# Altium schematic sheet Main.SchDoc
size A
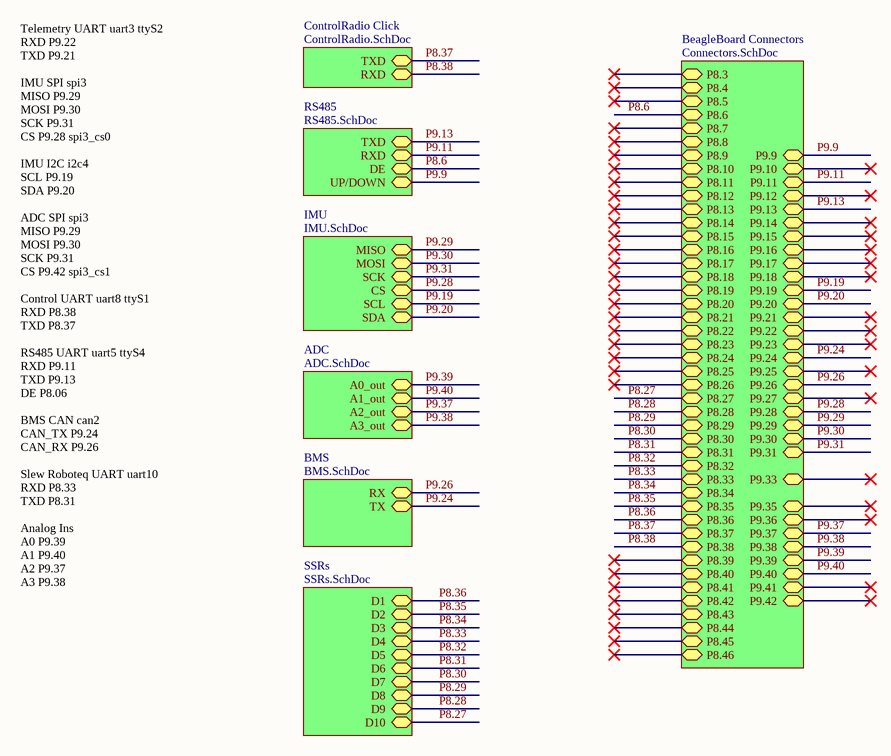
[diagram p0: Main.SchDoc]

## Sub-sheets
ADC = ADC.SchDoc: A2_out, A3_out, A0_out, A1_out
BeagleBoard Connectors = Connectors.SchDoc: P9.42, P9.17, P8.18, P9.21, P8.32, P9.33, P9.23, P8.28, P9.19, P9.16, P9.12, P9.31, P8.26, P9.15, P8.41, P9.36, P8.46, P8.36, P9.14, P8.12, P9.13, P9.20, P9.11, P8.20, P9.40, P8.24, P9.28, P9.30, P9.24, P9.22, P9.18, P8.22, P8.16, P8.44, P9.38, P8.38, P8.34, P9.26, P8.43, P9.25, P8.42, P9.41, P9.35, P9.27, P9.37, P9.39, P8.10, P8.30, P8.14, P8.45, P8.6, P9.29, P9.10, P8.4, P9.9, P8.8, P8.40, P8.5, P8.27, P8.3, P8.21, P8.7, P8.39, P8.19, P8.17, P8.15, P8.13, P8.35, P8.33, P8.37, P8.23, P8.9, P8.11, P8.25, P8.31, P8.29
BMS = BMS.SchDoc: RX, TX
ControlRadio Click = ControlRadio.SchDoc: TXD, RXD
IMU = IMU.SchDoc: MISO, MOSI, SCK, CS, SCL, SDA
RS485 = RS485.SchDoc: TXD, RXD, DE, UP/DOWN
SSRs = SSRs.SchDoc: D1, D2, D3, D4, D5, D6, D7, D8, D9, D10

## Nets
P8.6: sheet RS485/DE, sheet BeagleBoard Connectors/P8.6
P8.27: sheet BeagleBoard Connectors/P8.27, sheet SSRs/D10
P8.28: sheet BeagleBoard Connectors/P8.28, sheet SSRs/D9
P8.29: sheet BeagleBoard Connectors/P8.29, sheet SSRs/D8
P8.30: sheet BeagleBoard Connectors/P8.30, sheet SSRs/D7
P8.31: sheet BeagleBoard Connectors/P8.31, sheet SSRs/D6
P8.32: sheet BeagleBoard Connectors/P8.32, sheet SSRs/D5
P8.33: sheet BeagleBoard Connectors/P8.33, sheet SSRs/D4
P8.34: sheet BeagleBoard Connectors/P8.34, sheet SSRs/D3
P8.35: sheet BeagleBoard Connectors/P8.35, sheet SSRs/D2
P8.36: sheet BeagleBoard Connectors/P8.36, sheet SSRs/D1
P8.37: sheet BeagleBoard Connectors/P8.37, sheet ControlRadio Click/TXD
P8.38: sheet BeagleBoard Connectors/P8.38, sheet ControlRadio Click/RXD
P9.9: sheet RS485/UP/DOWN, sheet BeagleBoard Connectors/P9.9
P9.11: sheet RS485/RXD, sheet BeagleBoard Connectors/P9.11
P9.13: sheet RS485/TXD, sheet BeagleBoard Connectors/P9.13
P9.19: sheet IMU/SCL, sheet BeagleBoard Connectors/P9.19
P9.20: sheet IMU/SDA, sheet BeagleBoard Connectors/P9.20
P9.24: sheet BeagleBoard Connectors/P9.24, sheet BMS/TX
P9.26: sheet BeagleBoard Connectors/P9.26, sheet BMS/RX
P9.28: sheet IMU/CS, sheet BeagleBoard Connectors/P9.28
P9.29: sheet IMU/MISO, sheet BeagleBoard Connectors/P9.29
P9.30: sheet IMU/MOSI, sheet BeagleBoard Connectors/P9.30
P9.31: sheet IMU/SCK, sheet BeagleBoard Connectors/P9.31
P9.37: sheet ADC/A2_out, sheet BeagleBoard Connectors/P9.37
P9.38: sheet ADC/A3_out, sheet BeagleBoard Connectors/P9.38
P9.39: sheet ADC/A0_out, sheet BeagleBoard Connectors/P9.39
P9.40: sheet ADC/A1_out, sheet BeagleBoard Connectors/P9.40

## Notes on the sheet
- Telemetry UART uart3 ttyS2
  RXD P9.22
  TXD P9.21
  IMU SPI spi3
  MISO P9.29
  MOSI P9.30
  SCK P9.31
  CS P9.28 spi3_cs0
  IMU I2C i2c4
  SCL P9.19
  SDA P9.20
  ADC SPI spi3
  MISO P9.29
  MOSI P9.30
  SCK P9.31
  CS P9.42 spi3_cs1
  Control UART uart8 ttyS1
  RXD P8.38
  TXD P8.37
  RS485 UART uart5 ttyS4
  RXD P9.11
  TXD P9.13
  DE P8.06
  BMS CAN can2
  CAN_TX P9.24
  CAN_RX P9.26
  Slew Roboteq UART uart10
  RXD P8.33
  TXD P8.31
  Analog Ins
  A0 P9.39
  A1 P9.40
  A2 P9.37
  A3 P9.38